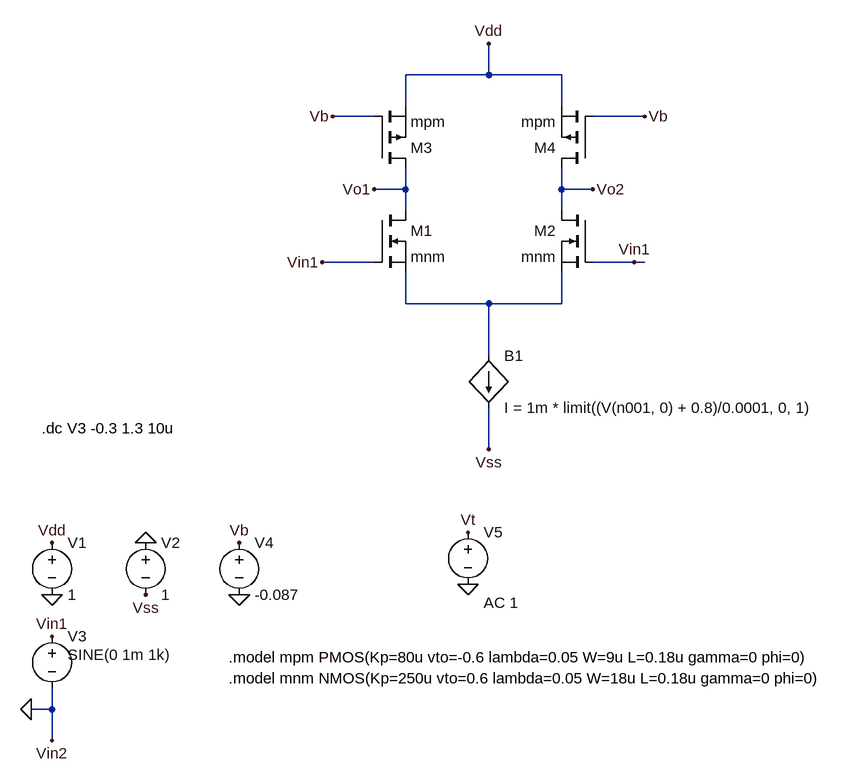
[diagram p0: schematic P2.asc]
P2.asc, the LTspice schematic file:
Version 4
SHEET 1 880 740
WIRE -160 -592 -160 -640
WIRE -160 -592 -288 -592
WIRE -48 -592 -160 -592
WIRE -288 -544 -288 -592
WIRE -48 -544 -48 -592
WIRE -336 -528 -400 -528
WIRE 80 -528 0 -528
WIRE -288 -416 -288 -448
WIRE -288 -416 -336 -416
WIRE -48 -416 -48 -448
WIRE 0 -416 -48 -416
WIRE -288 -384 -288 -416
WIRE -48 -384 -48 -416
WIRE -336 -304 -416 -304
WIRE 64 -304 0 -304
WIRE 80 -304 64 -304
WIRE -288 -240 -288 -288
WIRE -160 -240 -288 -240
WIRE -48 -240 -48 -288
WIRE -48 -240 -160 -240
WIRE -160 -160 -160 -240
WIRE -160 -16 -160 -80
WIRE -832 384 -832 352
WIRE -832 384 -864 384
WIRE -832 432 -832 384
FLAG -832 208 0
FLAG -688 128 0
FLAG -832 272 Vin1
FLAG -832 128 Vdd
FLAG -688 208 Vss
FLAG 64 -304 Vin1
FLAG -160 -640 Vdd
FLAG -160 -16 Vss
FLAG -864 384 0
FLAG -832 432 Vin2
FLAG -336 -416 Vo1
FLAG 0 -416 Vo2
FLAG -400 -528 Vb
FLAG 80 -528 Vb
FLAG -544 208 0
FLAG -544 128 Vb
FLAG -192 192 0
FLAG -192 112 Vt
FLAG -416 -304 Vin1
SYMBOL nmos -336 -384 R0
SYMATTR InstName M1
SYMATTR Value mnm
SYMBOL nmos 0 -384 M0
SYMATTR InstName M2
SYMATTR Value mnm
SYMBOL voltage -832 112 R0
SYMATTR InstName V1
SYMATTR Value 1
SYMBOL voltage -688 112 R0
SYMATTR InstName V2
SYMATTR Value 1
SYMBOL voltage -832 256 R0
WINDOW 3 24 44 Left 2
WINDOW 123 24 72 Left 2
WINDOW 39 0 0 Left 0
SYMATTR Value SINE(0 1m 1k)
SYMATTR InstName V3
SYMBOL bi -160 -160 R0
SYMATTR InstName B1
SYMATTR Value I = 1m * limit((V(n001, 0) + 0.8)/0.0001, 0, 1)
SYMBOL pmos -336 -448 M180
SYMATTR InstName M3
SYMATTR Value mpm
SYMBOL pmos 0 -448 R180
SYMATTR InstName M4
SYMATTR Value mpm
SYMBOL voltage -544 112 R0
SYMATTR InstName V4
SYMATTR Value -0.087
SYMBOL voltage -192 96 R0
WINDOW 123 24 124 Left 2
WINDOW 39 0 0 Left 0
SYMATTR Value2 AC 1
SYMATTR InstName V5
SYMATTR Value ""
TEXT -560 304 Left 2 !.model mpm PMOS(Kp=80u vto=-0.6 lambda=0.05 W=9u L=0.18u gamma=0 phi=0)
TEXT -560 336 Left 2 !.model mnm NMOS(Kp=250u vto=0.6 lambda=0.05 W=18u L=0.18u gamma=0 phi=0)
TEXT -848 -48 Left 2 !.dc V3 -0.3 1.3 10u

The netlist it stands for:
* P2.asc
M1 Vo1 Vin1 N001 N001 mnm
M2 Vo2 Vin1 N001 N001 mnm
V1 Vdd 0 1
V2 0 Vss 1
V3 Vin1 0 SINE(0 1m 1k)
B1 N001 Vss I = 1m * limit((V(n001, 0) + 0.8)/0.0001, 0, 1)
M3 Vo1 Vb Vdd Vdd mpm
M4 Vo2 Vb Vdd Vdd mpm
V4 Vb 0 -0.087
V5 Vt 0 AC 1
.model NMOS NMOS
.model PMOS PMOS
.lib standard.mos
.model mpm PMOS(Kp=80u vto=-0.6 lambda=0.05 W=9u L=0.18u gamma=0 phi=0)
.model mnm NMOS(Kp=250u vto=0.6 lambda=0.05 W=18u L=0.18u gamma=0 phi=0)
.dc V3 -0.3 1.3 10u
.backanno
.end